# Altium schematic sheet Pg2 Battery Contacts.SchDoc: EV Kartz Main BMS
size Letter; Organization: Kettering University; Address1: EV Kartz; Address2: Battery Project; Address3: Flint, MI; Address4: United States of America; DocumentNumber: 1; Revision: 1; SheetNumber: 2; SheetTotal: 2
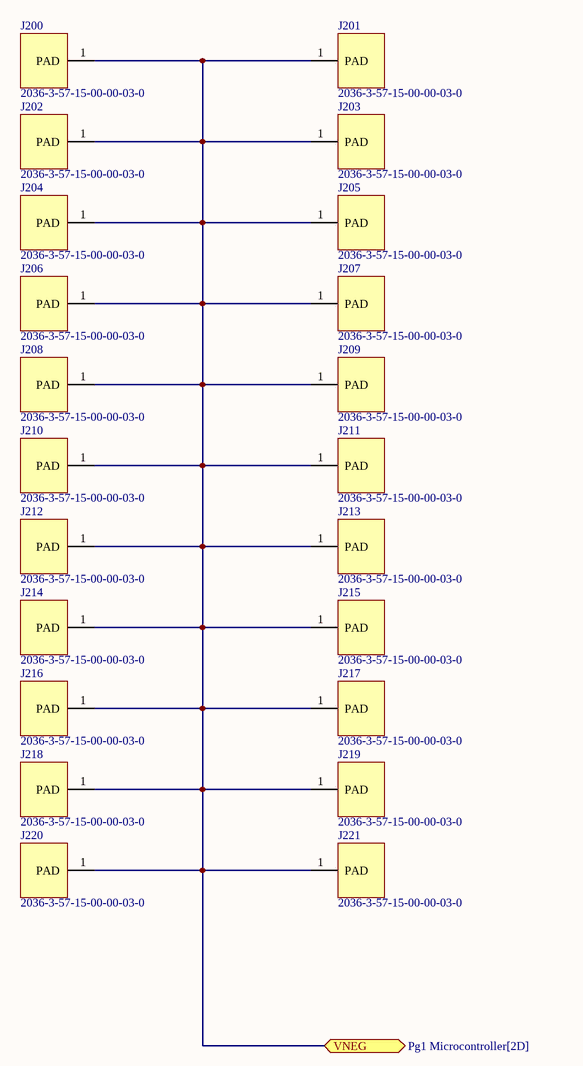
[diagram p0: Pg2 Battery Contacts.SchDoc]

## Parts
J200  2036-3-57-15-00-00-03-0  [6mm Pad]
J201  2036-3-57-15-00-00-03-0  [6mm Pad]
J202  2036-3-57-15-00-00-03-0  [6mm Pad]
J203  2036-3-57-15-00-00-03-0  [6mm Pad]
J204  2036-3-57-15-00-00-03-0  [6mm Pad]
J205  2036-3-57-15-00-00-03-0  [6mm Pad]
J206  2036-3-57-15-00-00-03-0  [6mm Pad]
J207  2036-3-57-15-00-00-03-0  [6mm Pad]
J208  2036-3-57-15-00-00-03-0  [6mm Pad]
J209  2036-3-57-15-00-00-03-0  [6mm Pad]
J210  2036-3-57-15-00-00-03-0  [6mm Pad]
J211  2036-3-57-15-00-00-03-0  [6mm Pad]
J212  2036-3-57-15-00-00-03-0  [6mm Pad]
J213  2036-3-57-15-00-00-03-0  [6mm Pad]
J214  2036-3-57-15-00-00-03-0  [6mm Pad]
J215  2036-3-57-15-00-00-03-0  [6mm Pad]
J216  2036-3-57-15-00-00-03-0  [6mm Pad]
J217  2036-3-57-15-00-00-03-0  [6mm Pad]
J218  2036-3-57-15-00-00-03-0  [6mm Pad]
J219  2036-3-57-15-00-00-03-0  [6mm Pad]
J220  2036-3-57-15-00-00-03-0  [6mm Pad]
J221  2036-3-57-15-00-00-03-0  [6mm Pad]

## Ports
VNEG (bidir, see Pg1 Microcontroller[2D])

## Nets
VNEG: J200.1(PAD) J201.1(PAD) J202.1(PAD) J203.1(PAD) J204.1(PAD) J205.1(PAD) J206.1(PAD) J207.1(PAD) J208.1(PAD) J209.1(PAD) J210.1(PAD) J211.1(PAD) J212.1(PAD) J213.1(PAD) J214.1(PAD) J215.1(PAD) J216.1(PAD) J217.1(PAD) J218.1(PAD) J219.1(PAD) J220.1(PAD) J221.1(PAD) ; port VNEG

## Notes on the sheet
- Title
- Size:
- Date:
- Letter
- Number:
- Time:
- Revision:
- Sheet
- of
- File:

## Library data of the parts
J200-J221 = 2036-3-57-15-00-00-03-0: Hardware, Sprint Contact Surface; Supplier 1: Digi-Key; Supplier Part Number 1: 54-2036-3-57-15-00-00-03-0CT-ND